# Altium schematic sheet linux-H-zero.SchDoc
size A3; SheetNumber: 1; SheetTotal: 2
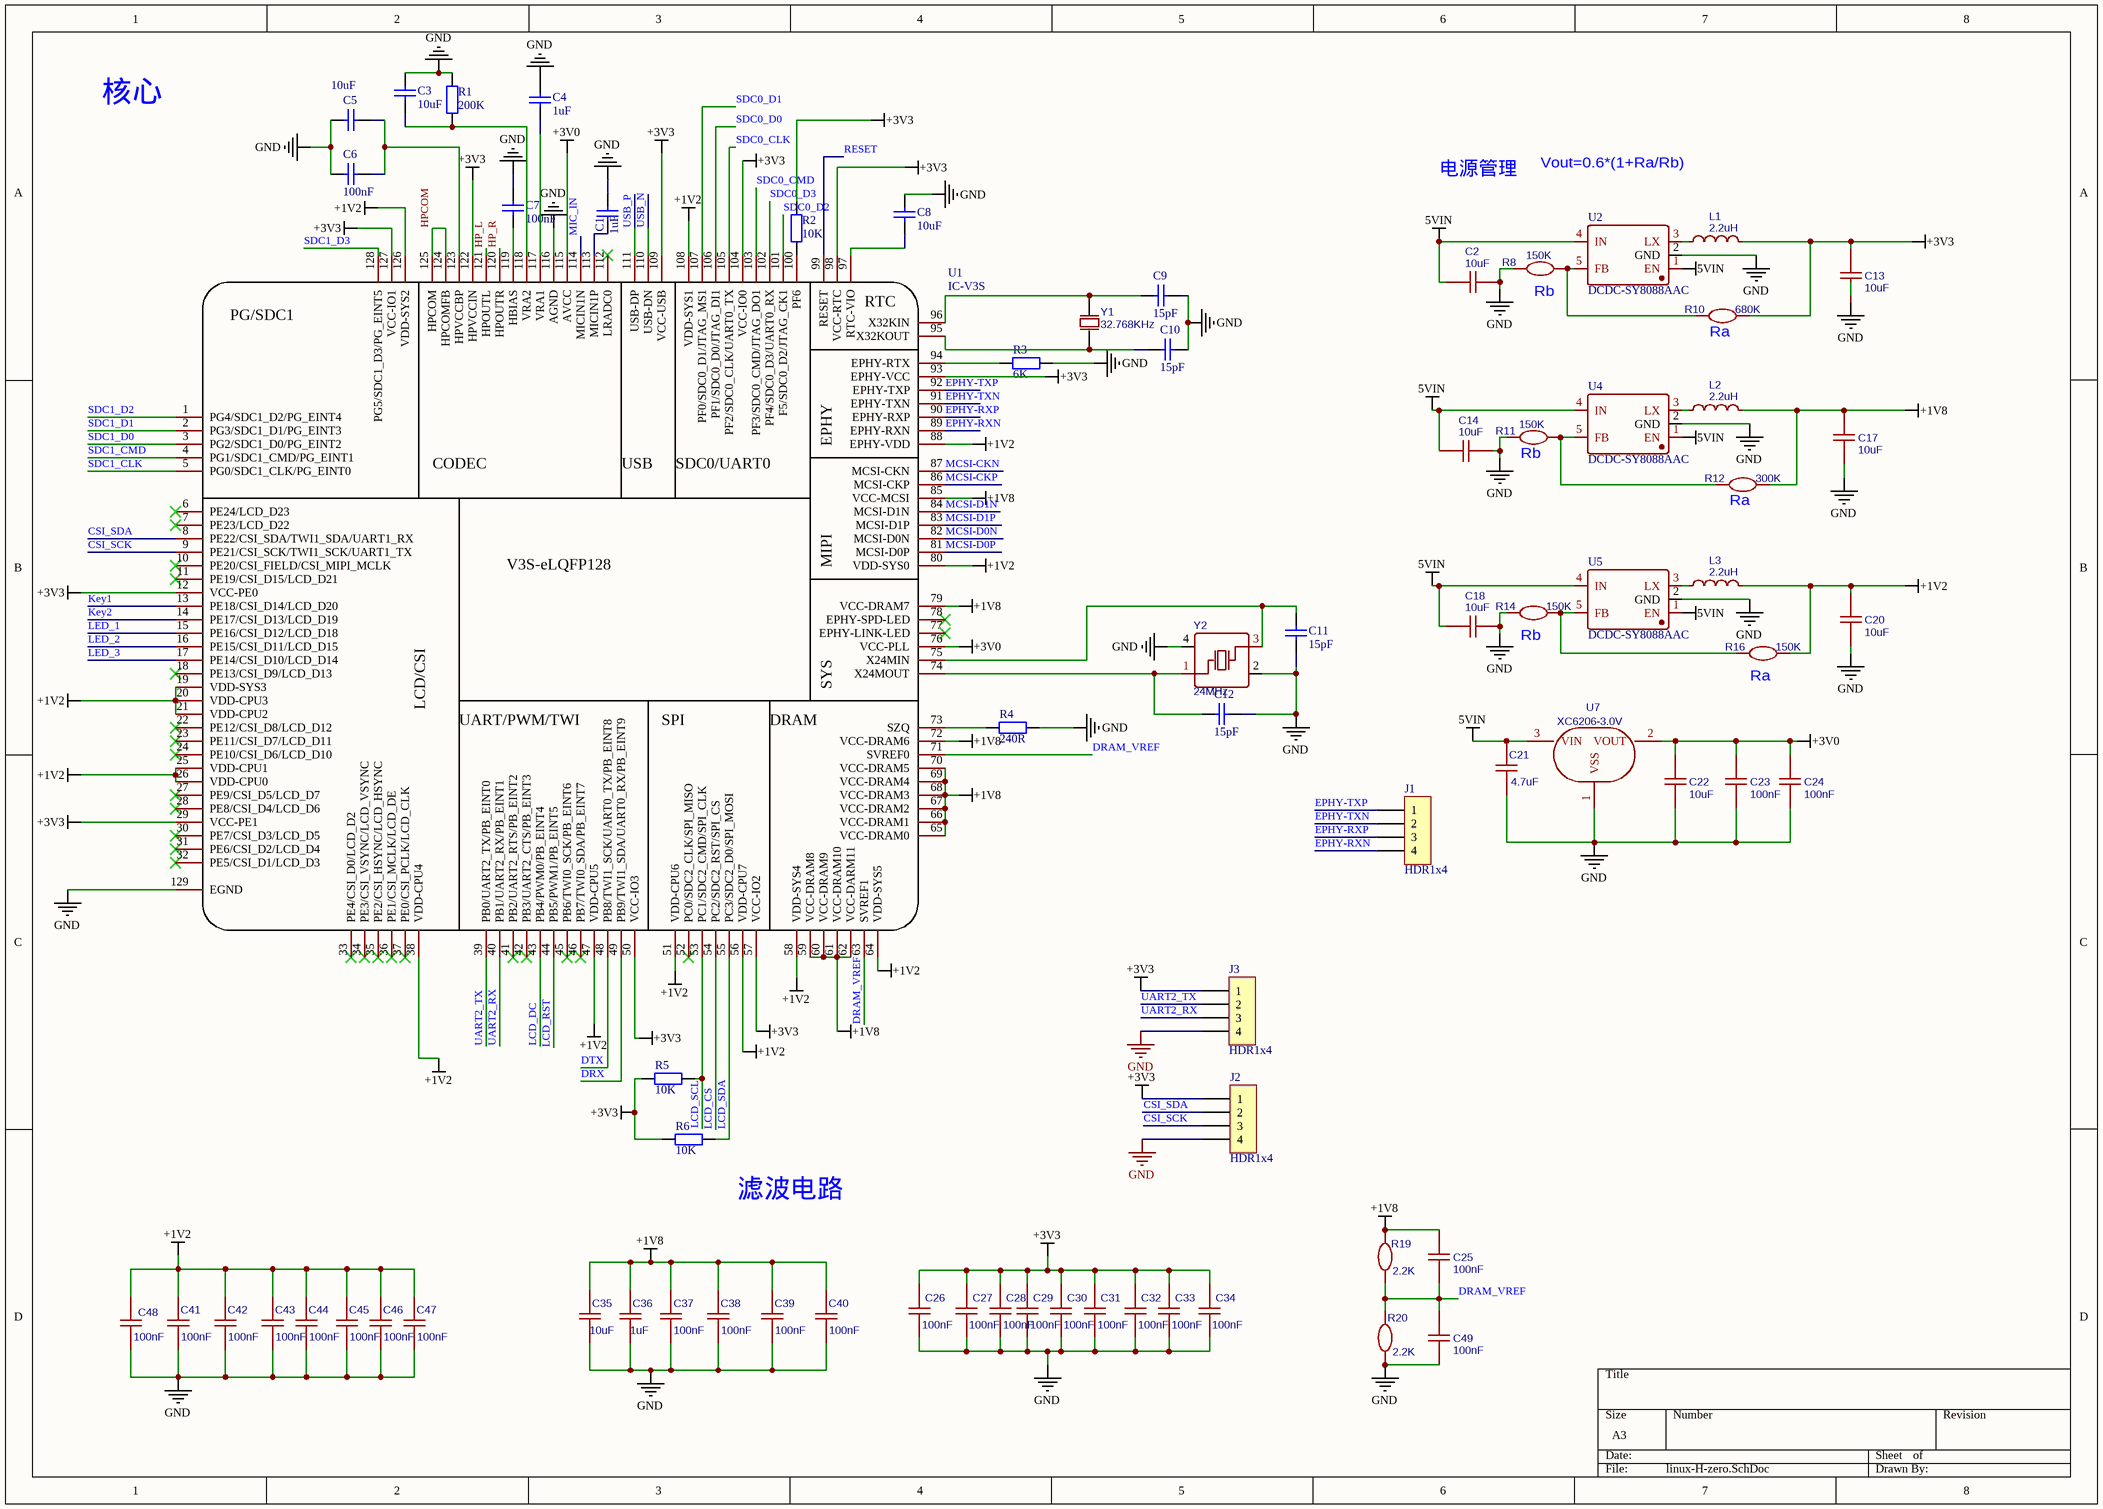
[diagram p0: linux-H-zero.SchDoc]

## Parts
C1  1uF  [C0603-S]
C2  10uF  [C0603-S]
C3  10uF  [C0603-S]
C4  1uF  [C0603-S]
C5  10uF  [C0603-S]
C6  100nF  [C0603-S]
C7  100nF  [C0603-S]
C8  10uF  [C0603-S]
C9  15pF  [C0603-S]
C10  15pF  [C0603-S]
C11  15pF  [C0603-S]
C12  15pF  [C0603-S]
C13  10uF  [C0603-S]
C14  10uF  [C0603-S]
C17  10uF  [C0603-S]
C18  10uF  [C0603-S]
C20  10uF  [C0603-S]
C21  4.7uF  [C0603-S]
C22  10uF  [C0603-S]
C23  100nF  [C0603-S]
C24  100nF  [C0603-S]
C25  100nF  [C0603-S]
C26  100nF  [C0603-S]
C27  100nF  [C0603-S]
C28  100nF  [C0603-S]
C29  100nF  [C0603-S]
C30  100nF  [C0603-S]
C31  100nF  [C0603-S]
C32  100nF  [C0603-S]
C33  100nF  [C0603-S]
C34  100nF  [C0603-S]
C35  10uF  [C0603-S]
C36  1uF  [C0603-S]
C37  100nF  [C0603-S]
C38  100nF  [C0603-S]
C39  100nF  [C0603-S]
C40  100nF  [C0603-S]
C41  100nF  [C0603-S]
C42  100nF  [C0603-S]
C43  100nF  [C0603-S]
C44  100nF  [C0603-S]
C45  100nF  [C0603-S]
C46  100nF  [C0603-S]
C47  100nF  [C0603-S]
C48  100nF  [C0603-S]
C49  100nF  [C0603-S]
J1  HDR1x4  [T-4PIN]
J2  HDR1x4  [T-4PIN]
J3  HDR1x4  [T-4PIN]
L1  2.2uH  [L0805]
L2  2.2uH  [L0805]
L3  2.2uH  [L0805]
R1  200K  [R0603-S]
R2  10K  [R0603-S]
R3  6K  [R0603-S]
R4  240R  [R0603-S]
R5  10K  [R0603-S]
R6  10K  [R0603-S]
R8  150K  [R0603-S]
R10  680K  [R0603-S]
R11  150K  [R0603-S]
R12  300K  [R0603-S]
R14  150K  [R0603-S]
R16  150K  [R0603-S]
R19  2.2K  [R0603-S]
R20  2.2K  [R0603-S]
U1  IC-V3S  [IC-V3S]
U2  DCDC-SY8088AAC  [SOT-23-5_L3.0-W1.7-P0.95-LS2.8-BR]
U4  DCDC-SY8088AAC  [SOT-23-5_L3.0-W1.7-P0.95-LS2.8-BR]
U5  DCDC-SY8088AAC  [SOT-23-5_L3.0-W1.7-P0.95-LS2.8-BR]
U7  XC6206-3.0V  [SOT-23]
Y1  32.768KHz  [OSC-SMD_L3.2-W1.5]
Y2  24MHz  [OSC-SMD_4P-L3.2-W2.5-BL]

## Nets
5VIN: C2.1 C14.1 C18.1 C21.2 U2.1(EN) U2.4(IN) U4.1(EN) U4.4(IN) U5.1(EN) U5.4(IN) U7.3(VIN)
+1V2: C20.2 C41.2 C42.2 C43.2 C44.2 C45.2 C46.2 C47.2 C48.2 L3.2 R16.2 U1.19(VDD-SYS3) U1.20(VDD-CPU3) U1.21(VDD-CPU2) U1.25(VDD-CPU1) U1.26(VDD-CPU0) U1.38(VDD-CPU4) U1.47(VDD-CPU5) U1.51(VDD-CPU6) U1.56(VDD-CPU7) U1.58(VDD-SYS4) U1.64(VDD-SYS5) U1.80(VDD-SYS0) U1.88(EPHY-VDD) U1.108(VDD-SYS1) U1.126(VDD-SYS2)
+1V8: C17.2 C25.2 C35.2 C36.2 C37.2 C38.2 C39.2 C40.2 L2.2 R12.2 R19.2 U1.59(VCC-DRAM8) U1.60(VCC-DRAM9) U1.61(VCC-DRAM10) U1.62(VCC-DARM11) U1.65(VCC-DRAM0) U1.66(VCC-DRAM1) U1.67(VCC-DRAM2) U1.68(VCC-DRAM3) U1.69(VCC-DRAM4) U1.70(VCC-DRAM5) U1.72(VCC-DRAM6) U1.79(VCC-DRAM7) U1.85(VCC-MCSI)
+3V0: C22.2 C23.2 C24.2 U1.76(VCC-PLL) U1.115(AVCC) U7.2(VOUT)
+3V3: C13.2 C26.1 C27.1 C28.1 C29.1 C30.1 C31.1 C32.1 C33.1 C34.1 J2.1 J3.1 L1.2 R2.2 R5.2 R6.2 R10.2 U1.12(VCC-PE0) U1.29(VCC-PE1) U1.50(VCC-IO3) U1.57(VCC-IO2) U1.93(EPHY-VCC) U1.98(VCC-RTC) U1.104(VCC-IO0) U1.109(VCC-USB) U1.122(HPVCCIN) U1.127(VCC-IO1)
GND: C1.2 C2.2 C3.2 C4.2 C5.1 C6.1 C7.2 C8.2 C9.2 C10.2 C11.1 C12.2 C13.1 C14.2 C17.1 C18.2 C20.1 C21.1 C22.1 C23.1 C24.1 C26.2 C27.2 C28.2 C29.2 C30.2 C31.2 C32.2 C33.2 C34.2 C35.1 C36.1 C37.1 C38.1 C39.1 C40.1 C41.1 C42.1 C43.1 C44.1 C45.1 C46.1 C47.1 C48.1 C49.1 J2.4 J3.4 R1.2 R3.1 R4.1 R8.1 R11.1 R14.1 R20.1 U1.116(AGND) U1.129(EGND) U2.2(GND) U4.2(GND) U5.2(GND) U7.1(VSS) Y2.2(GND) Y2.4(GND)
CSI_SCK: J2.3 U1.9(PE21/CSI_SCK/TWI1_SCK/UART1_TX)
CSI_SDA: J2.2 U1.8(PE22/CSI_SDA/TWI1_SDA/UART1_RX)
DRAM_VREF: C25.1 C49.2 R19.1 R20.2 U1.63(SVREF1) U1.71(SVREF0)
DRX: U1.49(PB9/TWI1_SDA/UART0_RX/PB_EINT9)
DTX: U1.48(PB8/TWI1_SCK/UART0_TX/PB_EINT8)
EPHY-RXN: J1.4 U1.89(EPHY-RXN)
EPHY-RXP: J1.3 U1.90(EPHY-RXP)
EPHY-TXN: J1.2 U1.91(EPHY-TXN)
EPHY-TXP: J1.1 U1.92(EPHY-TXP)
HP_L: U1.121(HPOUTL)
HP_R: U1.120(HPOUTR)
HPCOM: U1.124(HPCOMFB) U1.125(HPCOM)
Key1: U1.13(PE18/CSI_D14/LCD_D20)
Key2: U1.14(PE17/CSI_D13/LCD_D19)
LCD_CS: U1.54(PC2/SDC2_RST/SPI_CS)
LCD_DC: U1.43(PB4/PWM0/PB_EINT4)
LCD_RST: U1.44(PB5/PWM1/PB_EINT5)
LCD_SCL: R5.1 U1.53(PC1/SDC2_CMD/SPI_CLK)
LCD_SDA: R6.1 U1.55(PC3/SDC2_D0/SPI_MOSI)
LED_1: U1.15(PE16/CSI_D12/LCD_D18)
LED_2: U1.16(PE15/CSI_D11/LCD_D15)
LED_3: U1.17(PE14/CSI_D10/LCD_D14)
MCSI-CKN: U1.87(MCSI-CKN)
MCSI-CKP: U1.86(MCSI-CKP)
MCSI-D0N: U1.82(MCSI-D0N)
MCSI-D0P: U1.81(MCSI-D0P)
MCSI-D1N: U1.84(MCSI-D1N)
MCSI-D1P: U1.83(MCSI-D1P)
MIC_IN: U1.114(MICIN1N)
RESET: U1.99(RESET)
SDC0_CLK: U1.105(PF2/SDC0_CLK/UART0_TX)
SDC0_CMD: U1.103(PF3/SDC0_CMD/JTAG_DO1)
SDC0_D0: U1.106(PF1/SDC0_D0/JTAG_DI1)
SDC0_D1: U1.107(PF0/SDC0_D1/JTAG_MS1)
SDC0_D2: U1.101(F5/SDC0_D2/JTAG_CK1)
SDC0_D3: U1.102(PF4/SDC0_D3/UART0_RX)
SDC1_CLK: U1.5(PG0/SDC1_CLK/PG_EINT0)
SDC1_CMD: U1.4(PG1/SDC1_CMD/PG_EINT1)
SDC1_D0: U1.3(PG2/SDC1_D0/PG_EINT2)
SDC1_D1: U1.2(PG3/SDC1_D1/PG_EINT3)
SDC1_D2: U1.1(PG4/SDC1_D2/PG_EINT4)
SDC1_D3: U1.128(PG5/SDC1_D3/PG_EINT5)
UART2_RX: J3.3 U1.40(PB1/UART2_RX/PB_EINT1)
UART2_TX: J3.2 U1.39(PB0/UART2_TX/PB_EINT0)
USB_N: U1.110(USB-DN)
USB_P: U1.111(USB-DP)
NetC1_1: C1.1 U1.113(MICIN1P)
NetC3_1: C3.1 R1.1 U1.118(VRA2)
NetC4_1: C4.1 U1.117(VRA1)
NetC5_2: C5.2 C6.2 U1.123(HPVCCBP)
NetC7_1: C7.1 U1.119(HBIAS)
NetC8_1: C8.1 U1.97(RTC-VIO)
NetC9_1: C9.1 U1.96(X32KIN) Y1.2(OSC2)
NetC10_1: C10.1 U1.95(X32KOUT) Y1.1(OSC1)
NetC11_2: C11.2 U1.75(X24MIN) Y2.3(OSC2)
NetC12_1: C12.1 U1.74(X24MOUT) Y2.1(OSC1)
NetL1_1: L1.1 U2.3(LX)
NetL2_1: L2.1 U4.3(LX)
NetL3_1: L3.1 U5.3(LX)
NetR2_1: R2.1 U1.100(PF6)
NetR3_2: R3.2 U1.94(EPHY-RTX)
NetR4_2: R4.2 U1.73(SZQ)
NetR8_2: R8.2 R10.1 U2.5(FB)
NetR11_2: R11.2 R12.1 U4.5(FB)
NetR14_2: R14.2 R16.1 U5.5(FB)

Not connected (* = marked no-connect by the designer): U1 6(PE24/LCD_D23)* 7(PE23/LCD_D22)* 10(PE20/CSI_FIELD/CSI_MIPI_MCLK)* 11(PE19/CSI_D15/LCD_D21)* 18(PE13/CSI_D9/LCD_D13)* 22(PE12/CSI_D8/LCD_D12)* 23(PE11/CSI_D7/LCD_D11)* 24(PE10/CSI_D6/LCD_D10)* 27(PE9/CSI_D5/LCD_D7)* 28(PE8/CSI_D4/LCD_D6)* 30(PE7/CSI_D3/LCD_D5)* 31(PE6/CSI_D2/LCD_D4)* 32(PE5/CSI_D1/LCD_D3)* 33(PE4/CSI_D0/LCD_D2)* 34(PE3/CSI_VSYNC/LCD_VSYNC)* 35(PE2/CSI_HSYNC/LCD_HSYNC)* 36(PE1/CSI_MCLK/LCD_DE)* 37(PE0/CSI_PCLK/LCD_CLK)* 41(PB2/UART2_RTS/PB_EINT2)* 42(PB3/UART2_CTS/PB_EINT3)* 45(PB6/TWI0_SCK/PB_EINT6)* 46(PB7/TWI0_SDA/PB_EINT7)* 52(PC0/SDC2_CLK/SPI_MISO)* 77(EPHY-LINK-LED)* 78(EPHY-SPD-LED)* 112(LRADC0)*

## Notes on the sheet
- 核心
- 电源管理
- Vout=0.6*(1+Ra/Rb)
- (near R8) Rb
- (near R10) Ra
- (near R11) Rb
- (near R12) Ra
- (near R14) Rb
- (near R16) Ra
- (near R6) 滤波电路
- (in symbol IC-V3S) RTC; PG/SDC1; EPHY; CODEC; USB; SDC0/UART0; MIPI; V3S-eLQFP128; SYS; LCD/CSI; UART/PWM/TWI; SPI; DRAM

## Library data of the parts
C1 C3-C12 = C0603
C2 C13 C14 C17 C18 C20 C22 C35 = 10uF: BOM_Manufacturer: Taiyo Yuden; BOM_Manufacturer Part: AMK107BJ106MA-T; nameAlias: Capacitance; Contributor: LCSC; BOM_Supplier: LCSC; BOM_Supplier Part: C524952; spicePre: C; spiceSymbolName: AMK107BJ106MA-T
C21 = 4.7uF: BOM_Manufacturer: Taiyo Yuden; BOM_Manufacturer Part: AMK107BJ106MA-T; nameAlias: Capacitance; Contributor: LCSC; BOM_Supplier: LCSC; BOM_Supplier Part: C524952; spicePre: C; spiceSymbolName: AMK107BJ106MA-T
C23-C34 C37-C49 = 100nF: BOM_Manufacturer: Taiyo Yuden; BOM_Manufacturer Part: AMK107BJ106MA-T; nameAlias: Capacitance; Contributor: LCSC; BOM_Supplier: LCSC; BOM_Supplier Part: C524952; spicePre: C; spiceSymbolName: AMK107BJ106MA-T
C36 = 1uF: BOM_Manufacturer: Taiyo Yuden; BOM_Manufacturer Part: AMK107BJ106MA-T; nameAlias: Capacitance; Contributor: LCSC; BOM_Supplier: LCSC; BOM_Supplier Part: C524952; spicePre: C; spiceSymbolName: AMK107BJ106MA-T
J1-J3 = HDR1x4: Connector
L1-L3 = 2.2uH: BOM_Manufacturer Part: CMI201209U2R2KT; BOM_Manufacturer: FH; nameAlias: Inductance; SMT Type: Basic; BOM_Supplier: LCSC; BOM_Supplier Part: C1043; BOM_JLCPCB SMD: Yes; spicePre: L; spiceSymbolName: CMI201209U2R2KT
R1-R6 = R0603
R8 R11 R14 R16 = 150K: BOM_Manufacturer: PANASONIC; BOM_Manufacturer Part: ERA3ARB103V; nameAlias: Resistance (Ohms); Contributor: LCSC; BOM_Supplier: LCSC; BOM_Supplier Part: C465746; BOM_JLCPCB Part Class: Extended Part; spicePre: R; spiceSymbolName: ERA3ARB103V
R10 = 680K: BOM_Manufacturer: PANASONIC; BOM_Manufacturer Part: ERA3ARB103V; nameAlias: Resistance (Ohms); Contributor: LCSC; BOM_Supplier: LCSC; BOM_Supplier Part: C465746; BOM_JLCPCB Part Class: Extended Part; spicePre: R; spiceSymbolName: ERA3ARB103V
R12 = 300K: BOM_Manufacturer: PANASONIC; BOM_Manufacturer Part: ERA3ARB103V; nameAlias: Resistance (Ohms); Contributor: LCSC; BOM_Supplier: LCSC; BOM_Supplier Part: C465746; BOM_JLCPCB Part Class: Extended Part; spicePre: R; spiceSymbolName: ERA3ARB103V
R19 R20 = 2.2K: BOM_Manufacturer: PANASONIC; BOM_Manufacturer Part: ERA3ARB103V; nameAlias: Resistance (Ohms); Contributor: LCSC; BOM_Supplier: LCSC; BOM_Supplier Part: C465746; BOM_JLCPCB Part Class: Extended Part; spicePre: R; spiceSymbolName: ERA3ARB103V
U7 = XC6206-3.0V: BOM_Manufacturer: Torex Semicon; BOM_Manufacturer Part: XC6206P232MR; Contributor: LCSC; BOM_Supplier: LCSC; BOM_Supplier Part: C17167; spicePre: U; spiceSymbolName: XC6206P232MR
Y1 = Y-32.768KHz: BOM_Manufacturer: TKD; BOM_Manufacturer Part: SF32K32768D31T-12.5; nameAlias: Frequency; Contributor: LCSC; Package Display: No; BOM_Supplier: LCSC; BOM_Supplier Part: C271654; spicePre: X; spiceSymbolName: SF32K32768D31T-12.5
Y2 = Y-24MHz: BOM_Manufacturer: YXC; BOM_Manufacturer Part: X322524MSB4SI; nameAlias: Frequency; SMT Type: Extend; BOM_Supplier: LCSC; BOM_Supplier Part: C15643; BOM_JLCPCB SMD: Yes; spicePre: X; spiceSymbolName: X322524MSB4SI